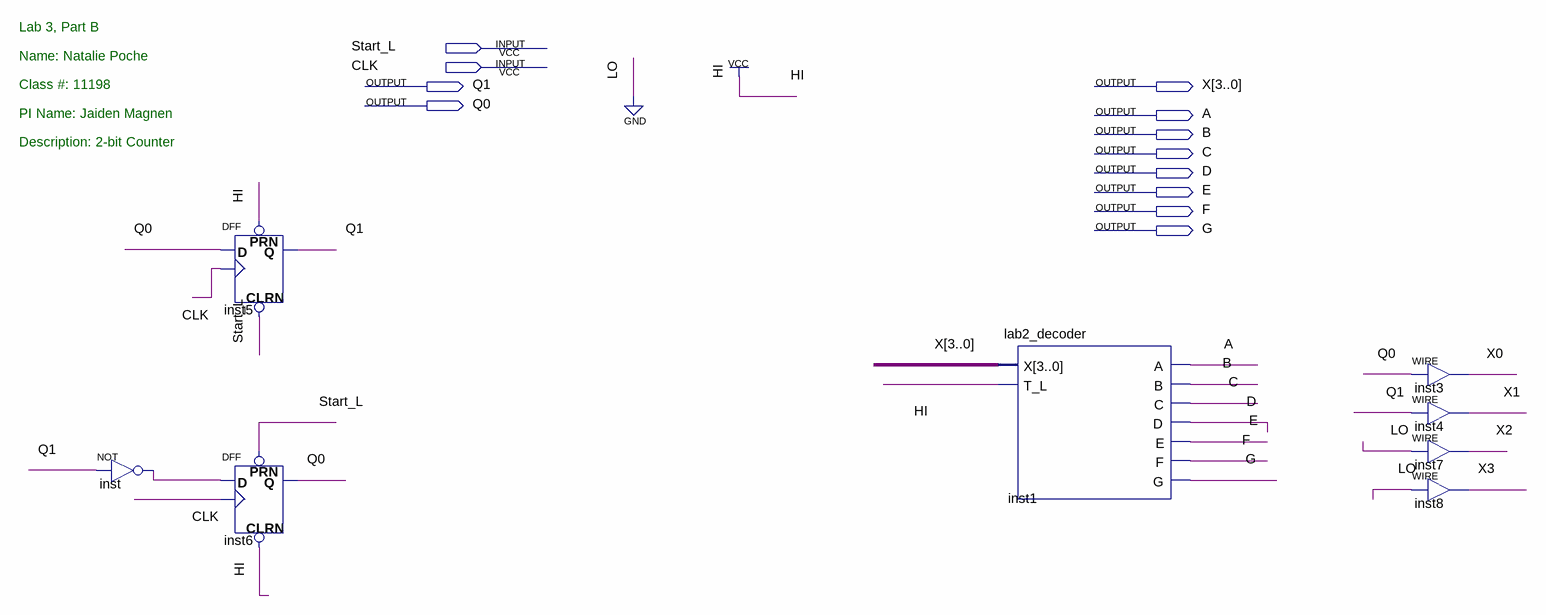
[diagram p0: schematic sheet]
// Quartus schematic Lab3_2bit_Cnt.bdf as structural Verilog: 8 symbols, 12 pins
module Lab3_2bit_Cnt (
  input  Start_L,
  input  CLK,
  output Q1,
  output [3:0] X,
  output Q0,
  output A,
  output B,
  output C,
  output D,
  output E,
  output F,
  output G
);

  wire inst_out;

  not inst (inst_out, Q1);
  DFF inst5 (.CLRN(Start_L), .CLK(CLK), .D(Q0), .PRN(1'b1), .Q(Q1));
  DFF inst6 (.CLRN(1'b1), .CLK(CLK), .D(inst_out), .PRN(Start_L), .Q(Q0));
  lab2_decoder inst1 (.X(X), .T_L(1'b1), .A(A), .B(B), .C(C), .D(D), .E(E), .F(F), .G(G));
  assign X[0] = Q0;  // WIRE inst3
  assign X[1] = Q1;  // WIRE inst4
  assign X[2] = 1'b0;  // WIRE inst7
  assign X[3] = 1'b0;  // WIRE inst8

  // Notes on the sheet:
  //   Lab 3, Part B
  //   Name: Natalie Poche
  //   Class #: 11198
  //   PI Name: Jaiden Magnen
  //   Description: 2-bit Counter
endmodule
